# EAGLE design head (EAGLE 9.0.1)
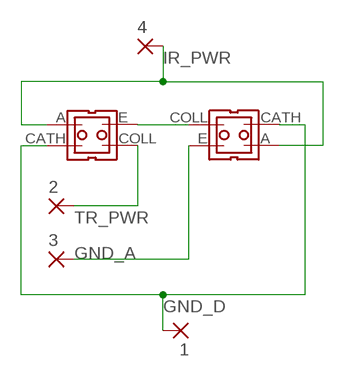
[diagram p0: schematic, sheet 1]

## Parts
1  2,15/1,0  [2,15/1,0]
2  2,15/1,0  [2,15/1,0]
3  2,15/1,0  [2,15/1,0]
4  2,15/1,0  [2,15/1,0]
U$1  CNY70  [CNY70]
U$2  CNY70  [CNY70]

## Nets
GND_A: 3.1(P) U$2.E(GND(PWR))
GND_D: 1.1(P) U$1.CATH(GND(DIG)) U$2.CATH(GND(DIG))
IR_PWR: 4.1(P) U$1.A(5V(DIG)) U$2.A(5V(DIG))
N$2: U$1.E(GND(PWR)) U$2.COLL(5V(PWR))
TR_PWR: 2.1(P) U$1.COLL(5V(PWR))

## Library data of the parts
1-4 = wirepad:2,15/1,0: THROUGH-HOLE PAD
U$1 U$2 = ferraris_sensor_project:CNY70

## Board
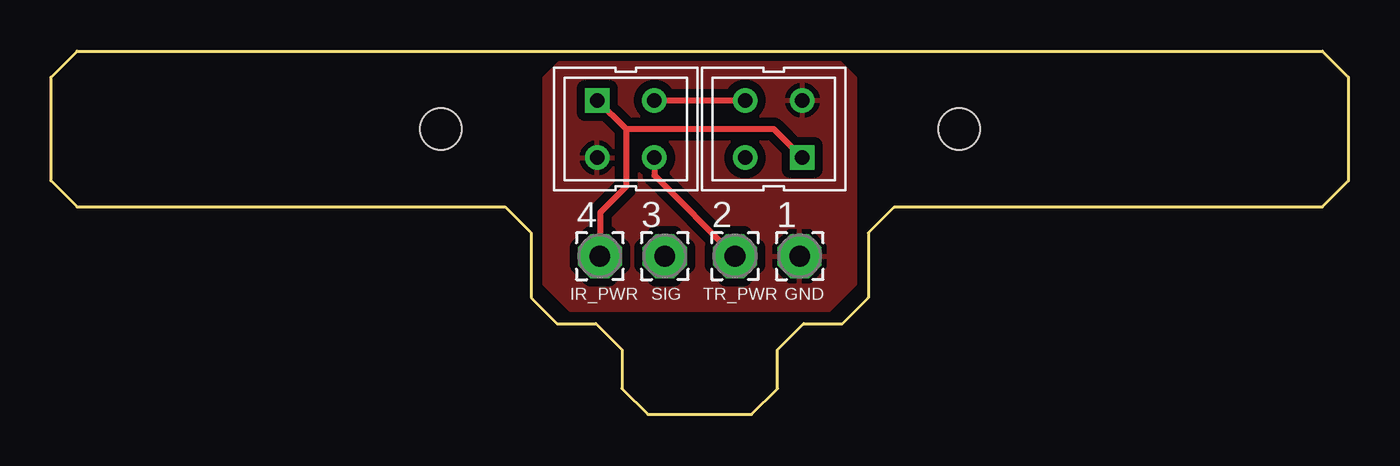
[diagram p1: board, top side]
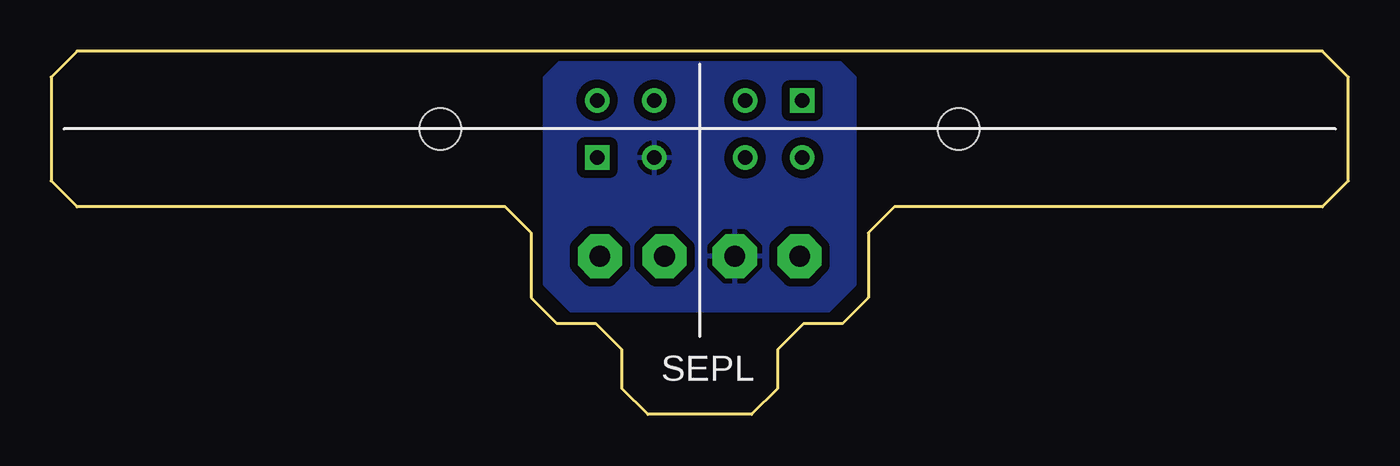
[diagram p2: board, bottom side, seen from below]

Size 63.5 x 17.78 mm. Coordinates in mm from the lower left corner, seen from the top.
Outline: 62.23,17.78 63.5,16.51 63.5,11.43 62.23,10.16 41.27,10.16 40.01,8.89 40.01,5.71 38.73,4.45 36.83,4.45 35.56,3.18 35.56,1.27 34.29,0 29.21,0 27.94,1.27 27.94,3.18 26.67,4.45 24.77,4.45 23.49,5.71 23.49,8.89 22.23,10.16 1.27,10.16 0,11.43 0,16.51 1.27,17.78 62.23,17.78
Copper layers (1*16): Top 0.035mm / dielectric 1.5mm / Bottom 0.035mm
Design rules "aisler_go_2layer *": minimum track width 0.1mm, minimum drill 0.2mm, track to track 0.1mm, track to pad 0.1mm, pad to pad 0.1mm, via to via 0.1mm, smd to smd 0.1mm, copper to edge 0.2mm, drill to drill 0.21mm, minimum pad ring 0.25mm, minimum via ring 0.05mm, stop-mask expansion 0.01mm, vias tented up to drill 0mil, thermal gap 10mil
Holes 2.03 mm at 19.08,13.97 44.45,13.97

### Footprints (pad centres in the part's own frame; a part is rotated, then mirrored left to right if it is on the bottom)
2,15/1,0 = drill 1.016 pad 2.159 octagon: 1 0,0
CNY70 = drill 0.7 square: A -1.4,1.4 | drill 0.7: CATH -1.4,-1.4; COLL 1.4,-1.4; E 1.4,1.4

### Placement (x,y rotation side)
1  36.64,7.75 0 top
2  33.48,7.75 0 top
3  30.04,7.75 0 top
4  26.86,7.75 0 top
U$1  28.13,13.97 0 top
U$2  35.37,13.97 180 top

### Tracks (layer width: path | path; a pad name or v marks a point on that pad's centre or on a via)
GND_A
  pour Bottom (isolate 0.406): 24.13,16.51 25.4,17.78 38.1,17.78 39.37,16.51 39.37,6.35 38.1,5.08 25.4,5.08 24.13,6.35
GND_D
  pour Top (isolate 0.406): 24.13,6.35 24.13,16.51 25.4,17.78 38.1,17.78 39.37,16.51 39.37,6.35 38.1,5.08 25.4,5.08
IR_PWR
  Top 0.305: U$1.A 28.13,13.97 | U$2.A 35.37,13.97 28.13,13.97 | 28.13,13.97 28.13,11.14 26.87,9.88 26.87,7.76 4.1
N$2
  Top 0.305: U$1.E U$2.COLL
TR_PWR
  Top 0.305: U$1.COLL 29.53,11.69 2.1

### Text on the board
tNames: IR_PWR | SIG | TR_PWR | GND
bNames: SEPL